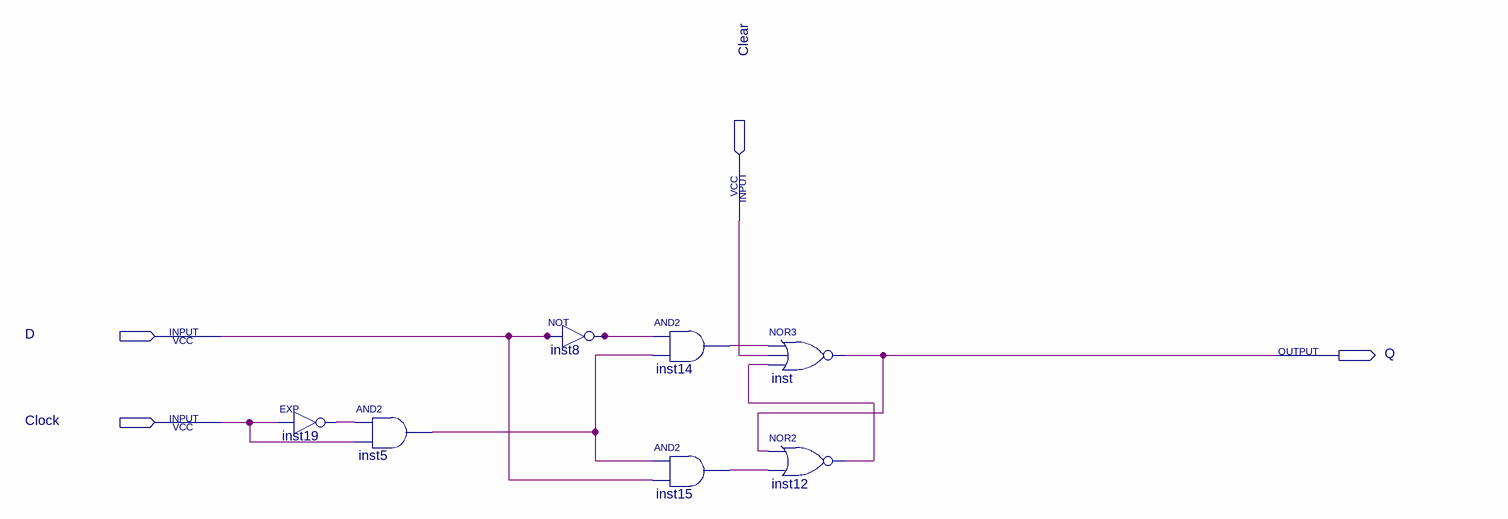
[diagram p0: schematic sheet]
// Quartus schematic FlipFlop-D.bdf as structural Verilog: 7 symbols, 4 pins
module \FlipFlop-D  (
  input  Clear,
  input  D,
  input  Clock,
  output Q
);

  wire inst5_out, inst8_out, inst12_out, inst14_out, inst15_out, inst19_out;

  EXP inst19 (.IN(Clock), .OUT(inst19_out));
  and inst5 (inst5_out, inst19_out, Clock);
  not inst8 (inst8_out, D);
  and inst14 (inst14_out, inst8_out, inst5_out);
  and inst15 (inst15_out, inst5_out, D);
  nor inst (Q, inst14_out, Clear, inst12_out);
  nor inst12 (inst12_out, Q, inst15_out);
endmodule
